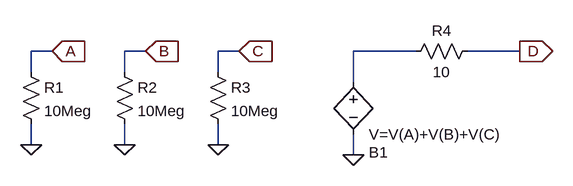
[diagram p0: schematic 3Summer5.asc]
3Summer5.asc, the LTspice schematic file:
Version 4
SHEET 1 880 680
WIRE -96 64 -128 64
WIRE 48 64 16 64
WIRE 192 64 160 64
WIRE 464 64 368 64
WIRE 624 64 544 64
WIRE -128 96 -128 64
WIRE 16 96 16 64
WIRE 160 96 160 64
WIRE 368 112 368 64
WIRE -128 208 -128 176
WIRE 16 208 16 176
WIRE 160 208 160 176
WIRE 368 224 368 192
FLAG 368 224 0
FLAG 624 64 D
IOPIN 624 64 Out
FLAG -128 208 0
FLAG 16 208 0
FLAG 160 208 0
FLAG -96 64 A
IOPIN -96 64 In
FLAG 48 64 B
IOPIN 48 64 In
FLAG 192 64 C
IOPIN 192 64 In
SYMBOL bv 368 96 R0
WINDOW 0 24 124 Left 2
SYMATTR InstName B1
SYMATTR Value V=V(A)+V(B)+V(C)
SYMBOL res -144 80 R0
SYMATTR InstName R1
SYMATTR Value 10Meg
SYMBOL res 0 80 R0
SYMATTR InstName R2
SYMATTR Value 10Meg
SYMBOL res 144 80 R0
SYMATTR InstName R3
SYMATTR Value 10Meg
SYMBOL res 560 48 R90
WINDOW 0 0 56 VBottom 2
WINDOW 3 32 56 VTop 2
SYMATTR InstName R4
SYMATTR Value 10

The netlist it stands for:
* 3Summer5.asc
B1 N001 0 V=V(A)+V(B)+V(C)
R1 A 0 10Meg
R2 B 0 10Meg
R3 C 0 10Meg
R4 D N001 10
.backanno
.end